# Altium project F103C8T6.PrjPcb
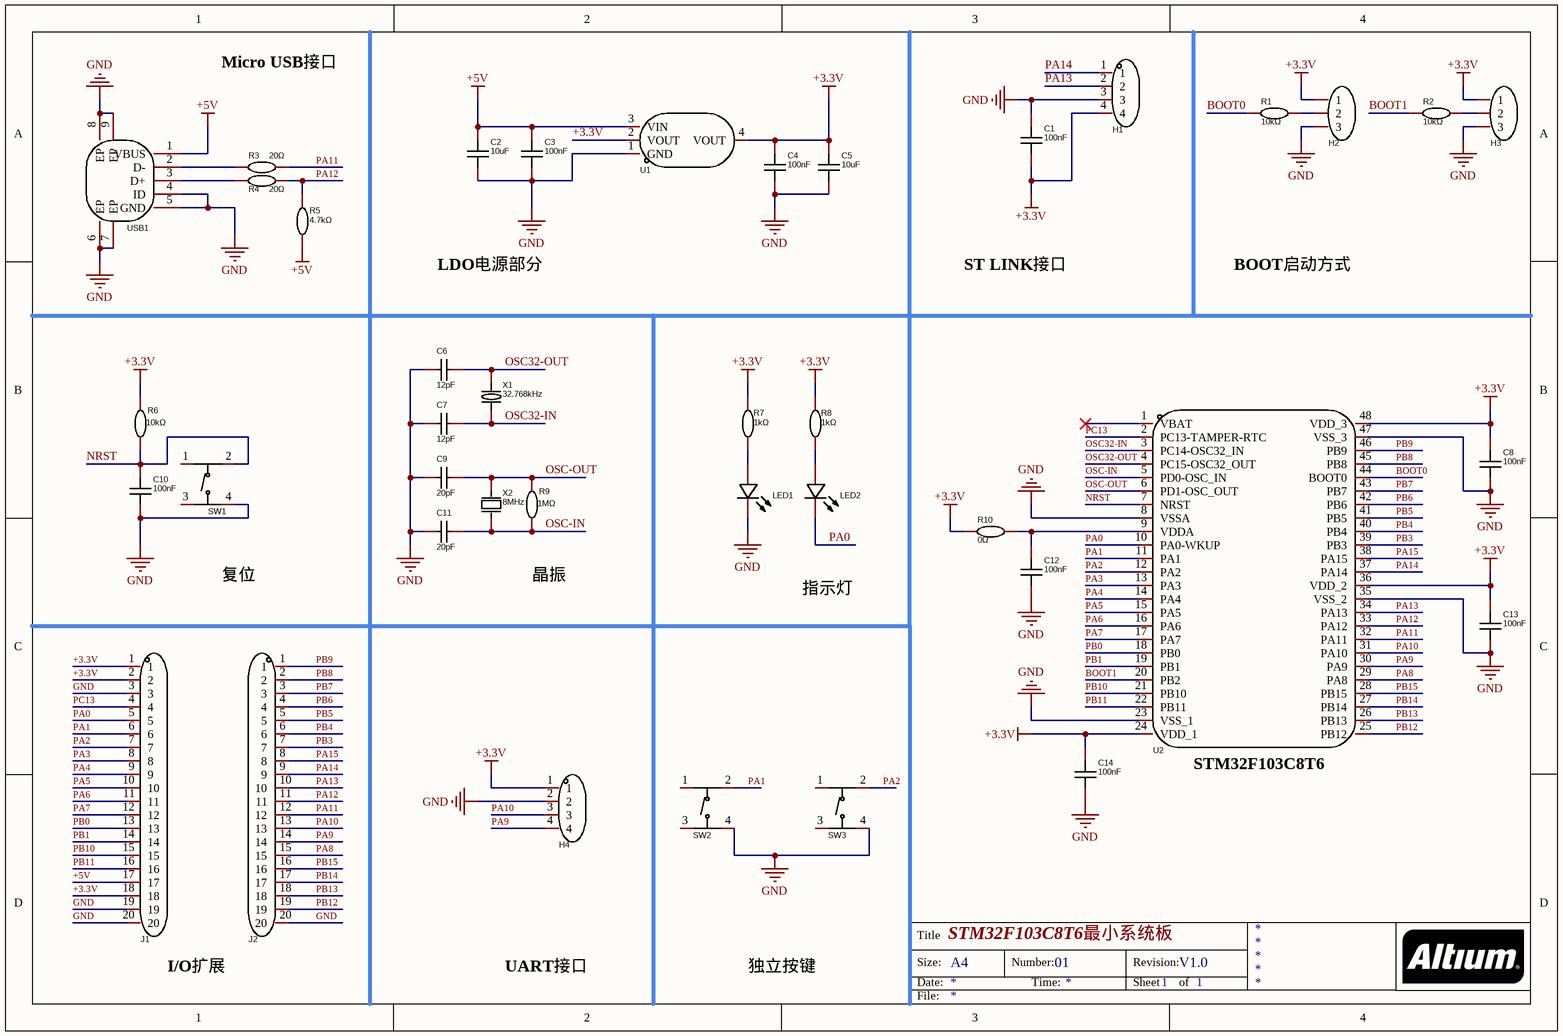
[diagram p0: F103C8T6.SchDoc]
1 sheet, 40 parts. Net scope: global (net labels, ports and power ports of the same name join across sheets).
Board file: F103C8T6.PcbDoc

## Sheet F103C8T6.SchDoc: STM32F103C8T6最小系统板
size A4; DocumentNumber: 01; Revision: V1.0; SheetNumber: 1; SheetTotal: 1

### Parts
C1  value 100nF  [C0603]  (hidden comment: CAP_100nf)
C2  value 10uF  [C0603]  (hidden comment: CAP_10uf)
C3  value 100nF  [C0603]  (hidden comment: CAP_100nf)
C4  value 100nF  [C0603]  (hidden comment: CAP_100nf)
C5  value 10uF  [C0603]  (hidden comment: CAP_10uf)
C6  value 12pF  [C0603]  (hidden comment: CAP_12pf_0603)
C7  value 12pF  [C0603]  (hidden comment: CAP_12pf_0603)
C8  value 100nF  [C0603]  (hidden comment: CAP_100nf)
C9  value 20pF  [C0603]  (hidden comment: CAP_20pf_0603)
C10  value 100nF  [C0603]  (hidden comment: CAP_100nf)
C11  value 20pF  [C0603]  (hidden comment: CAP_20pf_0603)
C12  value 100nF  [C0603]  (hidden comment: CAP_100nf)
C13  value 100nF  [C0603]  (hidden comment: CAP_100nf)
C14  value 100nF  [C0603]  (hidden comment: CAP_100nf)
H1  2.54-1*4P反弯排针  [HDR-TH_4P-P2.54-H-M-W10.4]  (value not drawn)
H2  2.54-1*3P针  [HDR-TH_3P-P2.54-V-M-1]  (value not drawn)
H3  2.54-1*3P针  [HDR-TH_3P-P2.54-V-M-1]  (value not drawn)
H4  PZ254V-11-04P  [HDR-TH_4P-P2.54-V-M]  (value not drawn)
J1  2.54-1*20P直针  [HDR-TH_20P-P2.54-V-M-1]  (value not drawn)
J2  2.54-1*20P直针  [HDR-TH_20P-P2.54-V-M-1]  (value not drawn)
LED1  NCD0805G1  [LED0805-Greed]  (value not drawn)
LED2  NCD0805R1  [LED0805-Red]  (value not drawn)
R1  value 10kΩ  [R0603]  (hidden comment: RES_10k_0603)
R2  value 10kΩ  [R0603]  (hidden comment: RES_10k_0603)
R3  value 20Ω  [R0603]  (hidden comment: RES_20Ω_0603)
R4  value 20Ω  [R0603]  (hidden comment: RES_20Ω_0603)
R5  value 4.7kΩ  [R0603]  (hidden comment: RES_4.7K_0603)
R6  value 10kΩ  [R0603]  (hidden comment: RES_10k_0603)
R7  value 1kΩ  [R0603]  (hidden comment: RES_1K_0603)
R8  value 1kΩ  [R0603]  (hidden comment: RES_1K_0603)
R9  value 1MΩ  [R0603]  (hidden comment: RES_1M_0603)
R10  value 0Ω  [R0603]  (hidden comment: RES_0Ω_0603)
SW1  TS-1187A-B-A-B  [SW-SMD_4P-L5.1-W5.1-P3.70-LS6.5-TL-2]  (value not drawn)
SW2  TS-1187A-B-A-B  [SW-SMD_4P-L5.1-W5.1-P3.70-LS6.5-TL-2]  (value not drawn)
SW3  TS-1187A-B-A-B  [SW-SMD_4P-L5.1-W5.1-P3.70-LS6.5-TL-2]  (value not drawn)
U1  AMS1117-3.3_C6186  [SOT-223-3_L6.5-W3.4-P2.30-LS7.0-BR]  (value not drawn)
U2  STM32F103C8T6  [LQFP-48_L7.0-W7.0-P0.50-LS9.0-BL]  (value not drawn)
USB1  920-F52A2021S10101  [MICRO-USB-SMD_5P_C40957]  (value not drawn)
X1  value 32.768kHz  [FC-135R_L3.2-W1.5]  (hidden comment: Q13FC1350000400)
X2  value 8MHz  [CRYSTAL-SMD_L5.0-W3.2]  (hidden comment: X50328MSB2GI)

### Nets
+3.3V: C1.2 C4.2 C5.2 C8.2 C13.2 C14.2 H1.4 H2.1 H3.1 H4.1 J1.1 J1.2 J1.18 R6.2 R7.2 R8.2 R10.1 U1.2(VOUT) U1.4(VOUT) U2.24(VDD_1) U2.36(VDD_2) U2.48(VDD_3)
+5V: C2.2 C3.2 J1.17 R5.1 U1.3(VIN) USB1.1(VBUS)
GND: C1.1 C2.1 C3.1 C4.1 C5.1 C6.1 C7.1 C8.1 C9.1 C10.1 C11.1 C12.1 C13.1 C14.1 H1.3 H2.3 H3.3 H4.2 J1.3 J1.19 J1.20 J2.20 LED1.2(K) SW1.4(D) SW2.4(D) SW3.4(D) U1.1(GND) U2.8(VSSA) U2.23(VSS_1) U2.35(VSS_2) U2.47(VSS_3) USB1.4(ID) USB1.5(GND) USB1.6(EP) USB1.7(EP) USB1.8(EP) USB1.9(EP)
BOOT0: R1.2 U2.44(BOOT0)
BOOT1: R2.2 U2.20(PB2)
NRST: C10.2 R6.1 SW1.2(B) U2.7(NRST)
OSC32-IN: C7.2 U2.3(PC14-OSC32_IN) X1.1
OSC32-OUT: C6.2 U2.4(PC15-OSC32_OUT) X1.2
OSC-IN: C11.2 R9.1 U2.5(PD0-OSC_IN) X2.1(OSC1)
OSC-OUT: C9.2 R9.2 U2.6(PD1-OSC_OUT) X2.2(OSC2)
PA0: J1.5 LED2.1(-) U2.10(PA0-WKUP)
PA1: J1.6 SW2.2(B) U2.11(PA1)
PA2: J1.7 SW3.2(B) U2.12(PA2)
PA3: J1.8 U2.13(PA3)
PA4: J1.9 U2.14(PA4)
PA5: J1.10 U2.15(PA5)
PA6: J1.11 U2.16(PA6)
PA7: J1.12 U2.17(PA7)
PA8: J2.15 U2.29(PA8)
PA9: H4.4 J2.14 U2.30(PA9)
PA10: H4.3 J2.13 U2.31(PA10)
PA11: J2.12 R3.2 U2.32(PA11)
PA12: J2.11 R4.2 R5.2 U2.33(PA12)
PA13: H1.2 J2.10 U2.34(PA13)
PA14: H1.1 J2.9 U2.37(PA14)
PA15: J2.8 U2.38(PA15)
PB0: J1.13 U2.18(PB0)
PB1: J1.14 U2.19(PB1)
PB3: J2.7 U2.39(PB3)
PB4: J2.6 U2.40(PB4)
PB5: J2.5 U2.41(PB5)
PB6: J2.4 U2.42(PB6)
PB7: J2.3 U2.43(PB7)
PB8: J2.2 U2.45(PB8)
PB9: J2.1 U2.46(PB9)
PB10: J1.15 U2.21(PB10)
PB11: J1.16 U2.22(PB11)
PB12: J2.19 U2.25(PB12)
PB13: J2.18 U2.26(PB13)
PB14: J2.17 U2.27(PB14)
PB15: J2.16 U2.28(PB15)
PC13: J1.4 U2.2(PC13-TAMPER-RTC)
NetC12_2: C12.2 R10.2 U2.9(VDDA)
NetH2_2: H2.2 R1.1
NetH3_2: H3.2 R2.1
NetLED1_1: LED1.1(A) R7.1
NetLED2_2: LED2.2(+) R8.1
NetR3_1: R3.1 USB1.2(D-)
NetR4_1: R4.1 USB1.3(D+)

Not connected (* = marked no-connect by the designer): SW1 1(A) 3(C); SW2 1(A) 3(C); SW3 1(A) 3(C); U2 1(VBAT)*

### Notes on the sheet
- Micro USB接口
- LDO电源部分
- ST LINK接口
- BOOT启动方式
- 复位
- 晶振
- 指示灯
- (near U2) STM32F103C8T6
- (near J1) I/O扩展
- UART接口
- 独立按键
- Title
- Size:
- Date:
- A4
- Number:
- Time:
- Revision:
- Sheet
- of
- File:

### Library data of the parts
C1 C3 C4 C8 C10 C12-C14 = CAP_100nf: Manufacturer: YAGEO(国巨); Symbol: CC0603KRX7R9BB104; Add into BOM: yes; Tolerance: ±10%; Voltage Rated: 50V; Temperature Coefficient: X7R; Name: 100nF; Device: CC0603KRX7R9BB104; LCSC Part Name: 100nF ±10% 50V; Supplier Part: C14663; Manufacturer Part: CC0603KRX7R9BB104; Supplier Footprint: 0603; JLCPCB Part Class: Basic Part; Datasheet: https://atta.szlcsc.com/upload/public/pdf/source/20170116/1484561234239.pdf; Supplier: LCSC; Convert to PCB: yes
C2 C5 = CAP_10uf: Manufacturer: SAMSUNG(三星); Symbol: CL10A106MA8NRNC; Add into BOM: yes; Tolerance: ±20%; Voltage Rated: 25V; Temperature Coefficient: X5R; Name: 10uF; Device: CL10A106MA8NRNC; LCSC Part Name: 10uF ±20% 25V; Supplier Part: C96446; Manufacturer Part: CL10A106MA8NRNC; Supplier Footprint: 0603; JLCPCB Part Class: Basic Part; Datasheet: https://atta.szlcsc.com/upload/public/pdf/source/20170325/1490427913016.pdf; Supplier: LCSC; Convert to PCB: yes
C6 C7 = CAP_12pf_0603: Manufacturer: SAMSUNG(三星); Symbol: CL10C120JB8NNNC; Add into BOM: yes; Tolerance: ±5%; Voltage Rated: 50V; Temperature Coefficient: C0G; Name: 12pF; Device: CL10C120JB8NNNC; LCSC Part Name: 12pF ±5% 50V; Supplier Part: C38523; Manufacturer Part: CL10C120JB8NNNC; Supplier Footprint: 0603; JLCPCB Part Class: Basic Part; Datasheet: https://atta.szlcsc.com/upload/public/pdf/source/20160103/1457707725436.pdf; Supplier: LCSC; Convert to PCB: yes
C9 C11 = CAP_20pf_0603: Manufacturer: SAMSUNG(三星); Symbol: CL10C200JB8NNNC; Add into BOM: yes; Tolerance: ±5%; Voltage Rated: 50V; Temperature Coefficient: C0G; Name: 20pF; Device: CL10C200JB8NNNC; LCSC Part Name: 20pF ±5% 50V; Supplier Part: C1648; Manufacturer Part: CL10C200JB8NNNC; Supplier Footprint: 0603; JLCPCB Part Class: Basic Part; Datasheet: https://atta.szlcsc.com/upload/public/pdf/source/20160103/1457707686863.pdf; Supplier: LCSC; Convert to PCB: yes
H1 = 2.54-1*4P反弯排针: Manufacturer: BOOMELE(博穆精密); Add into BOM: yes; Pitch: 2.54mm; Pin Structure: 1x4P; Circluar Pins/Square Pins: 方针; Current Rating (Max): 3A; Name: 2.54-1*4P反弯排针; Symbol: 2.54-1*4P反弯排针; Device: 2.54-1*4P反弯排针; LCSC Part Name: 2.54mm 1x4P 弯插 方针 托盘; Supplier Part: C91552; Manufacturer Part: 2.54-1*4P反弯排针; Supplier Footprint: 弯插,P=2.54mm; JLCPCB Part Class: Extended Part; Datasheet: https://atta.szlcsc.com/upload/public/pdf/source/20190508/C74252_03DDEC4696EE17172E44B96636392962.pdf; Supplier: LCSC; Convert to PCB: yes; Number of Rows: 单排; Number of Pins: 4; Row Spacing: -; Mounting Type: 弯插; Voltage Rating (Max): -; Length of Mating Pin: 6mm; Insulation Height: -; Length of End Connection Pin: -; Contact Material: -; Contact Plating: -; Operating Temperature Range: -55℃~+105℃; Color: 黑色
H2 H3 = 2.54-1*3P针: Manufacturer: BOOMELE(博穆精密); Symbol: Header-Male-2.54_1x3; Add into BOM: yes; Pitch: 2.54mm; Pin Structure: 1x3P; Circluar Pins/Square Pins: 方针; Current Rating (Max): 3A; Name: 2.54-1*3P针; Device: 2.54-1*3P针; LCSC Part Name: 2.54mm 1x3P 直插 方针; Supplier Part: C49257; Manufacturer Part: 2.54-1*3P针; Supplier Footprint: 插件,P=2.54mm; JLCPCB Part Class: Extended Part; Datasheet: https://atta.szlcsc.com/upload/public/pdf/source/20221018/3E9408392E35E6F57A28985E5F7BF5C9.pdf; Supplier: LCSC; Convert to PCB: yes; Number of Rows: 单排; Number of Pins: 3; Row Spacing: -; Mounting Type: 直插; Voltage Rating (Max): -; Length of Mating Pin: -; Insulation Height: -; Length of End Connection Pin: -; Contact Material: -; Contact Plating: -; Operating Temperature Range: -40℃~+105℃; Color: 黑色
H4 = 2.54-1*4P直针: Manufacturer: XFCN(兴飞); Symbol: PZ254V-11-04P_C2691448; Add into BOM: yes; Pitch: 2.54mm; Pin Structure: 1x4P; Circluar Pins/Square Pins: 方针; Current Rating (Max): 3A; Voltage Rating (Max): 250V; Name: PZ254V-11-04P; Device: PZ254V-11-04P; LCSC Part Name: 2.54mm 1x4P 直插 方针; Supplier Part: C2691448; Manufacturer Part: PZ254V-11-04P; Supplier Footprint: 直插,P=2.54mm; JLCPCB Part Class: Extended Part; Datasheet: https://atta.szlcsc.com/upload/public/pdf/source/20200309/C492403_F9F19131791D08044AD4F84F8E751A34.pdf; Supplier: LCSC; Convert to PCB: yes; Number of Rows: 单排; Number of Pins: 4; Row Spacing: -; Mounting Type: 直插; Length of Mating Pin: 6mm; Insulation Height: 2.5mm; Length of End Connection Pin: 3mm; Contact Material: -; Operating Temperature Range: -40℃~+105℃; Color: 黑色
J1 J2 = 2.54-1*20P直针: Manufacturer: BOOMELE(博穆精密); Symbol: Header-Male-2.54_1x20; Add into BOM: yes; Pitch: 2.54mm; Pin Structure: 1x20P; Circluar Pins/Square Pins: 方针; Current Rating (Max): 3A; Name: 2.54-1*20P直针; Device: 2.54-1*20P直针; LCSC Part Name: 2.54mm 1x20P 直插 方针; Supplier Part: C50981; Manufacturer Part: 2.54-1*20P直针; Supplier Footprint: 插件,P=2.54mm; JLCPCB Part Class: Extended Part; Datasheet: https://atta.szlcsc.com/upload/public/pdf/source/20151109/1457707571495.pdf; Supplier: LCSC; Convert to PCB: yes; Number of Rows: 单排; Number of Pins: 20; Row Spacing: -; Mounting Type: 直插; Voltage Rating (Max): -; Length of Mating Pin: -; Insulation Height: -; Length of End Connection Pin: -; Contact Material: 黄铜; Contact Plating: -; Operating Temperature Range: -40℃~+105℃; Color: 黑色
LED1 = LED_Greed_0805: Manufacturer: 国星光电; Symbol: FC-2012UGK-520D5; Add into BOM: yes; Emitted Color: 翠绿; Name: NCD0805G1; Device: NCD0805G1; LCSC Part Name: 翠绿; Supplier Part: C84260; Manufacturer Part: NCD0805G1; Supplier Footprint: 0805; JLCPCB Part Class: Extended Part; Datasheet: https://atta.szlcsc.com/upload/public/pdf/source/20200820/C84260_AFC7BF57C6FBA034D182BB8D10A67EFE.pdf; Supplier: LCSC; Convert to PCB: yes
LED2 = LED_Red_0805: Manufacturer: 国星光电; Symbol: FC-2012HRK-620D; Add into BOM: yes; Emitted Color: 红灯; Name: NCD0805R1; Device: NCD0805R1; LCSC Part Name: 红灯; Supplier Part: C84256; Manufacturer Part: NCD0805R1; Supplier Footprint: 0805; JLCPCB Part Class: Basic Part; Datasheet: https://atta.szlcsc.com/upload/public/pdf/source/20200820/C84256_F0A75A43B3EAD75808600A0514C76B99.pdf; Supplier: LCSC; Convert to PCB: yes
R1 R2 R6 = RES_10k_0603: Manufacturer: UNI-ROYAL(厚声); Symbol: 0603WAF1002T5E; Add into BOM: yes; Tolerance: ±1%; Power(Watts): 100mW; Temperature Coefficient: ±100ppm/℃; Overload Voltage (Max): 75V; Name: 10kΩ; Device: 0603WAF1002T5E; LCSC Part Name: 10kΩ ±1% 100mW; Supplier Part: C25804; Manufacturer Part: 0603WAF1002T5E; Supplier Footprint: 0603; JLCPCB Part Class: Basic Part; Datasheet: https://atta.szlcsc.com/upload/public/pdf/source/20200306/C422600_1E6D84923E4A46A82E41ADD87F860B5C.pdf; Supplier: LCSC; Convert to PCB: yes; Type: 厚膜电阻; Operating Temperature Range: -55℃~+155℃
R3 R4 = RES_20Ω_0603: Manufacturer: UNI-ROYAL(厚声); Symbol: 0603WAF200JT5E; Add into BOM: yes; Tolerance: ±1%; Temperature Coefficient: ±100ppm/℃; Power(Watts): 1/10W; Overload Voltage (Max): 75V; Name: 20Ω; Device: 0603WAF200JT5E; LCSC Part Name: 20Ω ±1%; Supplier Part: C22950; Manufacturer Part: 0603WAF200JT5E; Supplier Footprint: 0603; JLCPCB Part Class: Basic Part; Datasheet: https://atta.szlcsc.com/upload/public/pdf/source/20170920/C22950_1505900999591982337.pdf; Supplier: LCSC; Convert to PCB: yes; Operating Temperature Range: -55℃~+155℃
R5 = RES_4.7K_0603: Manufacturer: UNI-ROYAL(厚声); Symbol: 0603WAF1001T5E; Add into BOM: yes; Tolerance: ±1%; Power(Watts): 100mW; Temperature Coefficient: ±100ppm/℃; Overload Voltage (Max): 75V; Name: 4.7kΩ; Device: 0603WAF1001T5E; LCSC Part Name: 1kΩ ±1% 100mW; Supplier Part: C21190; Manufacturer Part: 0603WAF1001T5E; Supplier Footprint: 0603; JLCPCB Part Class: Basic Part; Datasheet: https://atta.szlcsc.com/upload/public/pdf/source/20200306/C422600_1E6D84923E4A46A82E41ADD87F860B5C.pdf; Supplier: LCSC; Convert to PCB: yes; Type: 厚膜电阻; Operating Temperature Range: -55℃~+155℃
R7 R8 = RES_1K_0603: Manufacturer: UNI-ROYAL(厚声); Symbol: 0603WAF1001T5E; Add into BOM: yes; Tolerance: ±1%; Power(Watts): 100mW; Temperature Coefficient: ±100ppm/℃; Overload Voltage (Max): 75V; Name: 1kΩ; Device: 0603WAF1001T5E; LCSC Part Name: 1kΩ ±1% 100mW; Supplier Part: C21190; Manufacturer Part: 0603WAF1001T5E; Supplier Footprint: 0603; JLCPCB Part Class: Basic Part; Datasheet: https://atta.szlcsc.com/upload/public/pdf/source/20200306/C422600_1E6D84923E4A46A82E41ADD87F860B5C.pdf; Supplier: LCSC; Convert to PCB: yes; Type: 厚膜电阻; Operating Temperature Range: -55℃~+155℃
R9 = RES_1M_0603: Manufacturer: UNI-ROYAL(厚声); Symbol: 0603WAF1002T5E; Add into BOM: yes; Tolerance: ±1%; Power(Watts): 100mW; Temperature Coefficient: ±100ppm/℃; Overload Voltage (Max): 75V; Name: 1MΩ; Device: 0603WAF1002T5E; LCSC Part Name: 10kΩ ±1% 100mW; Supplier Part: C25804; Manufacturer Part: 0603WAF1002T5E; Supplier Footprint: 0603; JLCPCB Part Class: Basic Part; Datasheet: https://atta.szlcsc.com/upload/public/pdf/source/20200306/C422600_1E6D84923E4A46A82E41ADD87F860B5C.pdf; Supplier: LCSC; Convert to PCB: yes; Type: 厚膜电阻; Operating Temperature Range: -55℃~+155℃
R10 = RES_0Ω_0603: Manufacturer: UNI-ROYAL(厚声); Symbol: 0603WAF0000T5E; Add into BOM: yes; Tolerance: ±1%; Power(Watts): 100mW; Overload Voltage (Max): 75V; Name: 0Ω; Device: 0603WAF0000T5E; LCSC Part Name: 0Ω ±1% 100mW; Supplier Part: C21189; Manufacturer Part: 0603WAF0000T5E; Supplier Footprint: 0603; JLCPCB Part Class: Basic Part; Datasheet: https://atta.szlcsc.com/upload/public/pdf/source/20200306/C422600_1E6D84923E4A46A82E41ADD87F860B5C.pdf; Supplier: LCSC; Convert to PCB: yes; Type: 厚膜电阻; Operating Temperature Range: -55℃~+155℃
SW1-SW3 = SW: Manufacturer: XKB Connectivity(中国星坤); Add into BOM: yes; Contact Current: 50mA; Voltage Rating (DC): 12V; Circuit: 单刀单掷; Actuator Style: 圆形按钮; Actuator/Cap Color: 金色; With Lamp: 无; Operating Force: 160gf; Mechanical Life: 100000; Switch Length: 5.1mm; Switch Height: 1.5mm; Strike Gundam: 否; Name: TS-1187A-B-A-B; Symbol: TS-1187A-B-A-B; Device: TS-1187A-B-A-B; LCSC Part Name: 5.1*5.1*1.5 防水金属头160gf; Supplier Part: C318884; Manufacturer Part: TS-1187A-B-A-B; Supplier Footprint: SMD; JLCPCB Part Class: Basic Part; Datasheet: https://atta.szlcsc.com/upload/public/pdf/source/20200227/C318884_1F20165719E1C4CAA3E10C4C359C6E26.pdf; Supplier: LCSC; Convert to PCB: yes; Insulation Resistance: -; Mounting Style: 立贴; Operating Temperature: -30℃~+85℃; Switch Width: 5.1mm
U1 = AMS1117-3.3_C6186: Manufacturer: AMS; Add into BOM: yes; Output Type: 固定; Output Polarity: 正; Number of Outputs: 1; Output Voltage: 3.3V; Dropout Voltage: 1.3V@(800mA); Output Current: 1A; Power Supply Rejection Ratio (PSRR): 72dB@(120Hz); Name: AMS1117-3.3; Symbol: AMS1117-3.3; Device: AMS1117-3.3_C6186; LCSC Part Name: 正 Vout=3.3V 1A 72dB@(120Hz); Supplier Part: C6186; Manufacturer Part: AMS1117-3.3; Supplier Footprint: SOT-223-3; JLCPCB Part Class: Basic Part; Datasheet: https://atta.szlcsc.com/upload/public/pdf/source/20180727/C6186_7A095716F0823C02F1997A905E26C086.pdf; Supplier: LCSC; Convert to PCB: yes; Maximum Input Voltage: -; Quiescent Current (Ground Current): -; Noise: -; Feature: -; Operating Temperature: -
U2 = STM32F103C8T6: Manufacturer: ST(意法半导体); Add into BOM: yes; CPU Core: ARM Cortex-M3; Maximum Frequency: 72MHz; Supply Voltage Range: 2V~3.6V; Internal Oscillator: 有; Program FLASH Size: 64K@x8bit; RAM Size: 20KB; GPIO Ports Number: 37; ADC (Units/Channels/bits): 1@x10ch/12bit; Peripherals / Functions / Protocol Stacks: 看门狗；DMA；看门狗；片载温度传感器; Name: STM32F103C8T6; Symbol: STM32F103C8T6; Device: STM32F103C8T6; LCSC Part Name: ARM Cortex-M3 72MHz 闪存：64K@x8bit RAM：20KB MSL=3; Supplier Part: C8734; Manufacturer Part: STM32F103C8T6; Supplier Footprint: LQFP-48(7x7); JLCPCB Part Class: Basic Part; Datasheet: https://atta.szlcsc.com/upload/public/pdf/source/20140724/1457707174202.pdf; Supplier: LCSC; Convert to PCB: yes; EEPROM/Data FLASH Size: -; Operating Temperature Range: -40℃~+85℃
USB1 = Micro-B: Manufacturer: 精拓金; Symbol: micro 5PBroken plate1.274 Pins; Add into BOM: yes; Gender: 母座; Number of Contacts: 5; Number of Ports: 1; Name: 920-F52A2021S10101; Device: 920-F52A2021S10101; LCSC Part Name: 920-F52A2021S10101; Supplier Part: C40957; Manufacturer Part: 920-F52A2021S10101; Supplier Footprint: -; JLCPCB Part Class: Extended Part; Datasheet: https://atta.szlcsc.com/upload/public/pdf/source/20210308/C40957_FC68CD1637FCE8729A4C46B59B3229A9.pdf; Supplier: LCSC; Convert to PCB: yes; Connector Type: Micro-B; Standard: USB 2
X1 = 32.768KHZ: Manufacturer: EPSON(爱普生); Add into BOM: yes; Crystal Type: 贴片无源晶振; Frequency Tolerance: ±20ppm; Load Capacitance: 12.5pF; Equivalent Series Resistance (ESR): 70kΩ; Name: 32.768kHz; Symbol: Q13FC1350000400; Device: Q13FC1350000400; LCSC Part Name: 32.768kHz ±20ppm 12.5pF; Supplier Part: C32346; Manufacturer Part: Q13FC1350000400; Supplier Footprint: SMD3215-2P; JLCPCB Part Class: Basic Part; Datasheet: https://atta.szlcsc.com/upload/public/pdf/source/20190108/C32346_746D6B07EAF90824457A96480007685F.pdf; Supplier: LCSC; Convert to PCB: yes; Operating Temperature: -40℃~+85℃
X2 = 8MHZ: Manufacturer: YXC(扬兴晶振); Add into BOM: yes; Crystal Type: 贴片无源晶振; Frequency Tolerance: ±10ppm; Frequency Stability: ±50ppm; Load Capacitance: 20pF; Name: 8MHz; Symbol: X50328MSB2GI; Device: X50328MSB2GI; LCSC Part Name: YSX530GA 8MHz ±10ppm 20pF; Supplier Part: C115962; Manufacturer Part: X50328MSB2GI; Supplier Footprint: SMD5032-2P; JLCPCB Part Class: Basic Part; Datasheet: https://atta.szlcsc.com/upload/public/pdf/source/20210329/C112559_847D3CACBA33ACCEB57DEA3AEBB187A1.pdf; Supplier: LCSC; Convert to PCB: yes; Operating Temperature: -40℃~+85℃